# Altium schematic sheet 前瞻.SchDoc
size A4
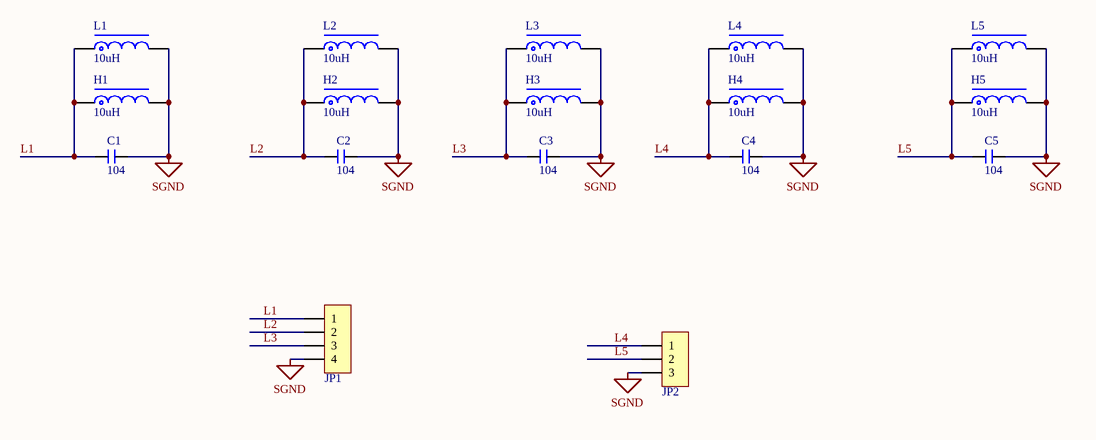
[diagram p0: 前瞻.SchDoc]

## Parts
C1  104  [谐振电容]
C2  104  [谐振电容]
C3  104  [谐振电容]
C4  104  [谐振电容]
C5  104  [谐振电容]
H1  10uH  [8*10工字电感]
H2  10uH  [8*10工字电感]
H3  10uH  [8*10工字电感]
H4  10uH  [8*10工字电感]
H5  10uH  [8*10工字电感]
JP1  HDR-1X4  [HDR2.54-WI-4P]  (value not drawn)
JP2  HDR-1X3  [HDR2.54-WI-3P]  (value not drawn)
L1  10uH  [8*10工字电感]
L2  10uH  [8*10工字电感]
L3  10uH  [8*10工字电感]
L4  10uH  [8*10工字电感]
L5  10uH  [8*10工字电感]

## Nets
SGND: C1.2 C2.2 C3.2 C4.2 C5.2 H1.2 H2.2 H3.2 H4.2 H5.2 JP1.4 JP2.3 L1.2 L2.2 L3.2 L4.2 L5.2
L1: C1.1 H1.1 JP1.1 L1.1
L2: C2.1 H2.1 JP1.2 L2.1
L3: C3.1 H3.1 JP1.3 L3.1
L4: C4.1 H4.1 JP2.1 L4.1
L5: C5.1 H5.1 JP2.2 L5.1

## Library data of the parts
C1-C5 = C: 贴片电容; BOM名称: 无极性贴片电容; 封装库来自淘宝卖家 ID：黄晶宝石: 其他店铺购入均为盗版假冒封装库; 联系卖家，免费查找封装: 唯一出售店铺网址https://shop463601444.taobao.com
H1-H5 L1-L5 = L-PK: 工字电感; 封装库来自淘宝卖家 ID：黄晶宝石: 其他店铺购入均为盗版假冒封装库; 联系卖家，免费查找封装: 唯一出售店铺网址https://shop463601444.taobao.com; BOM名称: 工字电感
JP1 = Header 4: 4P接插件; 封装库来自淘宝卖家  ID：黄晶宝石: 其他店铺购入均为盗版假冒封装库，请立即申请退款; 技术支持， 联系售后: 唯一出售店铺网址https://shop463601444.taobao.com; BOM名称: 4P接插件
JP2 = Header 3: 3P接插件; 封装库来自淘宝卖家  ID：黄晶宝石: 其他店铺购入均为盗版假冒封装库，请立即申请退款; 技术支持， 联系售后: 唯一出售店铺网址https://shop463601444.taobao.com; BOM名称: 3P接插件